# EasyEDA Pro project Cadenza-reference-ESP32-S3-game-console-original-v2-20260722.epro

# Schematic Schematic1
Board Name: Board1; Create Date: 2025-07-23; Page Name: P1; Project Name: ESP32-S3（非C3）小智AI; Schematic Name: Schematic1; Update Date: 2025-08-01; Company: 嘉立创EDA; Page Size: A4; Version: V1.0
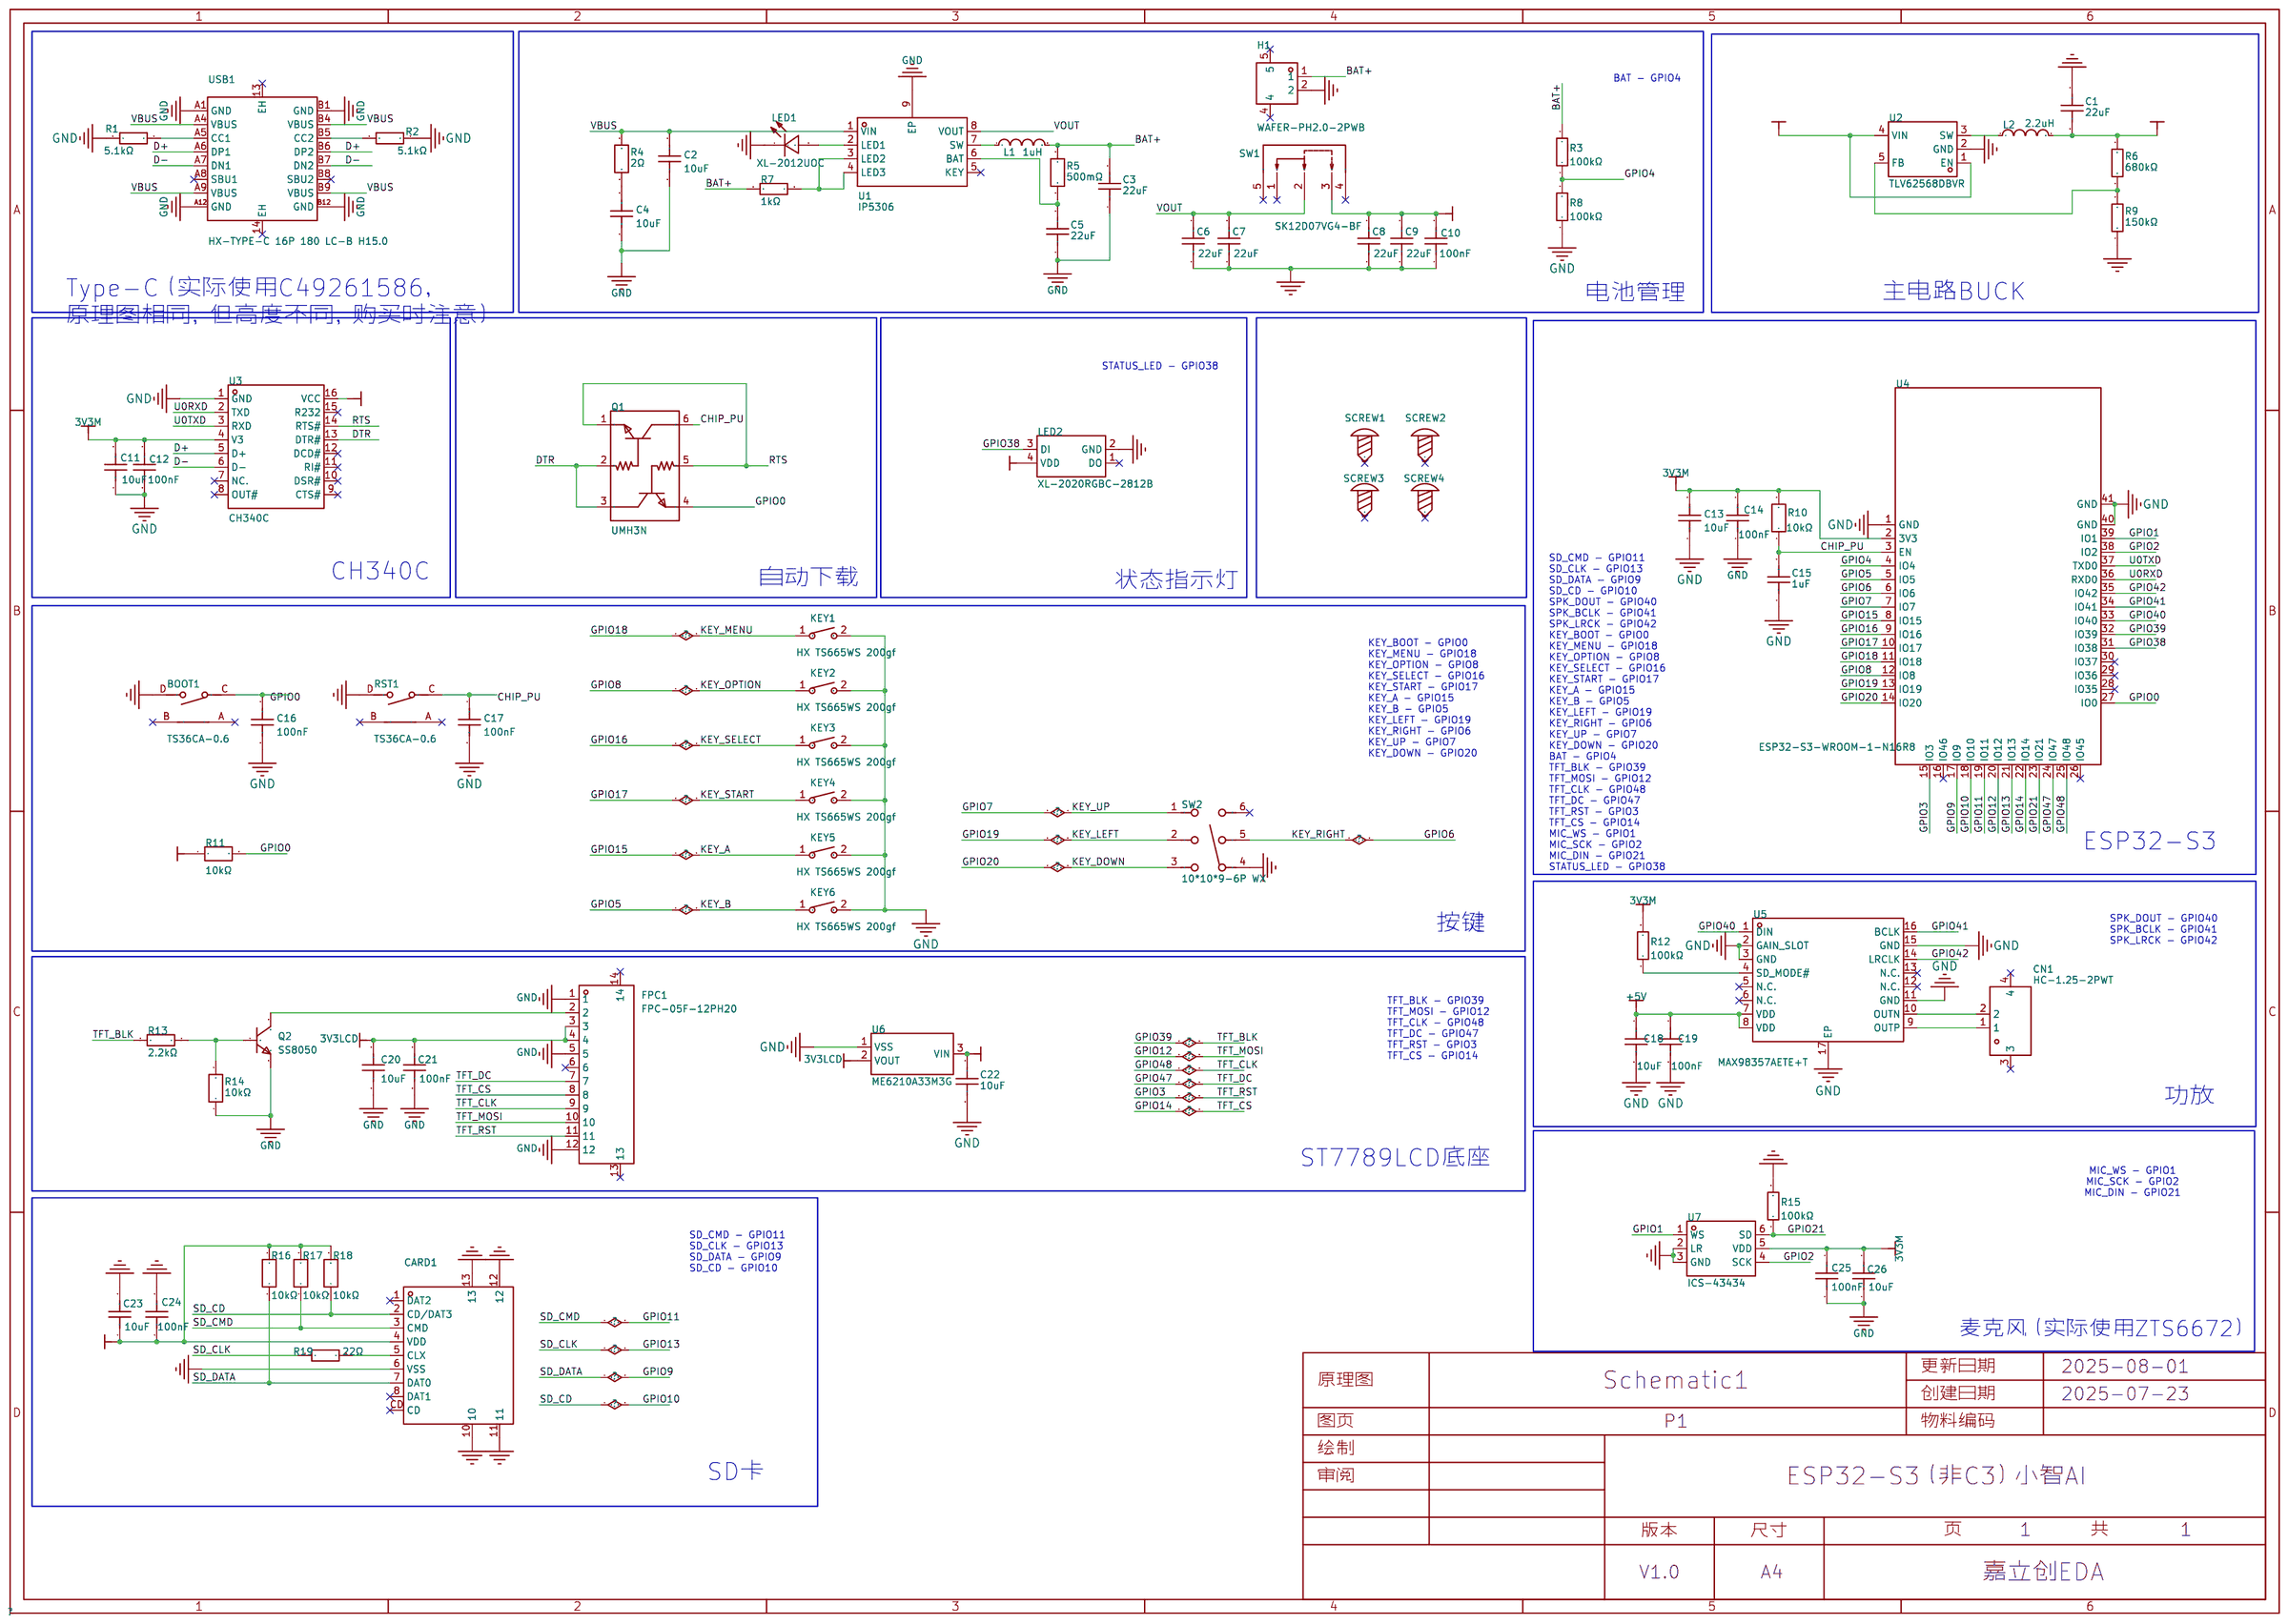
[diagram p0: schematic sheet]

## Parts
BOOT1  TS36CA-0.6  [SW-SMD_TS36CA]
C1  22uF  [C0805]
C2  10uF  [C0805]
C3  22uF  [C0805]
C4  10uF  [C0805]
C5  22uF  [C0805]
C6  22uF  [C0805]
C7  22uF  [C0805]
C8  22uF  [C0805]
C9  22uF  [C0805]
C10  100nF  [C0805]
C11  10uF  [C0805]
C12  100nF  [C0805]
C13  10uF  [C0805]
C14  100nF  [C0805]
C15  1uF  [C0805]
C16  100nF  [C0805]
C17  100nF  [C0805]
C18  10uF  [C0805]
C19  100nF  [C0805]
C20  10uF  [C0805]
C21  100nF  [C0805]
C22  10uF  [C0805]
C23  10uF  [C0805]
C24  100nF  [C0805]
C25  100nF  [C0805]
C26  10uF  [C0805]
CARD1  TF PUSH  [TF-SMD_TF-PUSH]
CN1  HC-1.25-2PWT  [CONN-SMD_2P-P1.25-HC-1.25-2PWT]
FPC1  FPC-05F-12PH20  [FPC-SMD_12P-P0.50_FPC-05F-12PH20]
H1  WAFER-PH2.0-2PWB  [CONN-SMD_2P-P2.00_XUNPU_WAFER-PH2.0-2PWB]
KEY1  HX TS665WS 200gf  [KEY-SMD_L6.0-W6.0-LS6.6]
KEY2  HX TS665WS 200gf  [KEY-SMD_L6.0-W6.0-LS6.6]
KEY3  HX TS665WS 200gf  [KEY-SMD_L6.0-W6.0-LS6.6]
KEY4  HX TS665WS 200gf  [KEY-SMD_L6.0-W6.0-LS6.6]
KEY5  HX TS665WS 200gf  [KEY-SMD_L6.0-W6.0-LS6.6]
KEY6  HX TS665WS 200gf  [KEY-SMD_L6.0-W6.0-LS6.6]
L1  1uH  [L0805]
L2  2.2uH  [IND-SMD_L3.0-W3.0_FNR30XXS]
LED1  XL-2012UOC  [LED0805-RD_ORANGE]
LED2  XL-2020RGBC-2812B  [LED-SMD_4P-L2.0-W2.0-BR-1]
Q1  UMH3N  [SC-70-6_L2.2-W1.3-P0.65-LS2.1-BR]
Q2  SS8050  [SOT-23-3_L2.9-W1.3-P1.90-LS2.4-BR]
R1  5.1kΩ  [R0805]
R2  5.1kΩ  [R0805]
R3  100kΩ  [R0805]
R4  2Ω  [R0805]
R5  500mΩ  [R0805]
R6  680kΩ  [R0805]
R7  1kΩ  [R0805]
R8  100kΩ  [R0805]
R9  150kΩ  [R0805]
R10  10kΩ  [R0805]
R11  10kΩ  [R0805]
R12  100kΩ  [R0805]
R13  2.2kΩ  [R0805]
R14  10kΩ  [R0805]
R15  100kΩ  [R0805]
R16  10kΩ  [R0805]
R17  10kΩ  [R0805]
R18  10kΩ  [R0805]
R19  22Ω  [R0805]
RST1  TS36CA-0.6  [SW-SMD_TS36CA]
SCREW1  -  [M2螺丝]
SCREW2  -  [M2螺丝]
SCREW3  -  [M2螺丝]
SCREW4  -  [M2螺丝]
SW1  SK12D07VG4-BF  [SW-TH_SK12D07VG4-BF]
SW2  10*10*9-6P WX  [SW-SMD-6P-L10.5-W10.0_C2858290]
U1  IP5306  [ESOP-8_L4.9-W3.9-P1.27-LS6.0-BL-EP]
U2  TLV62568DBVR  [SOT-23-5_L3.0-W1.7-P0.95-LS2.8-BR]
U3  CH340C  [SOP-16_L10.0-W3.9-P1.27-LS6.0-BL]
U4  ESP32-S3-WROOM-1-N16R8  [WIRELM-SMD_ESP32-S3-WROOM-1]
U5  MAX98357AETE+T  [TQFN-16_L3.0-W3.0-P0.50-BL-EP1.5]
U6  ME6210A33M3G  [SOT-23-3_L3.0-W1.7-P0.95-LS2.9-BR]
U7  ICS-43434  [MIC-SMD_6P-L3.5-W2.7-P0.90-BL]
USB1  HX-TYPE-C 16P 180 LC-B H15.0  [USB-C-TH_HX-TYPE-C-16P-180LC-BH15.0]

## Library data of the parts
BOOT1 RST1 = TS36CA-0.6: 电路结构:单刀单掷;按钮形状:矩形按钮;作用力:250gf;安装方式:卧贴;开关高度:3.5mm;触点电流:50mA;额定电压(DC):12V;绝缘电阻:100MΩ;机械寿命:3万次;; LCSC Part Name: 轻触开关 3*6*3.5侧按 直径0.6定位柱 白体黑头 250力度; Supplier Part: C2681481; Manufacturer: SHOU HAN(首韩); Supplier Footprint: SMD; JLCPCB Part Class: 扩展库; Datasheet: https://atta.szlcsc.com/upload/public/pdf/source/20210122/C2681481_EC49E45AE97AC1474E58FB36E84EF19B.pdf; Supplier: LCSC; Circuit: 单刀单掷; Actuator Style: 矩形按钮; Operating Force: 250gf; Mounting Style: 卧贴; Switch Height: 3.5mm; Contact Current: 50mA; Voltage Rating (DC): 12V; Insulation Resistance: 100MΩ; Actuator/Cap Color: 黑色; Pin Style: SMD接片; Mechanical Life: 3万次; Operating Temperature: -20℃~+70℃
C1 C3 C5-C9 = CL21A226MAQNNNE: 容值:22uF;精度:±20%;额定电压:25V;温度系数:X5R;; LCSC Part Name: 22uF ±20% 25V; Supplier Part: C45783; Manufacturer: SAMSUNG(三星); Supplier Footprint: 0805; JLCPCB Part Class: Basic Part; Datasheet: https://item.szlcsc.com/datasheet/CL21A226MAQNNNE/46786.html; Supplier: LCSC; Tolerance: ±20%; Voltage Rating: 25V; Temperature Coefficient: X5R
C2 C4 C11 C13 C18 C20 C22 C23 C26 = CGA0805X5R106K250MT: 容值:10uF;精度:±10%;额定电压:25V;温度系数:X5R;; LCSC Part Name: 10uF ±10% 25V; Supplier Part: C6119887; Manufacturer: HRE(芯声); Supplier Footprint: 0805; JLCPCB Part Class: 扩展库; Supplier: LCSC; Tolerance: ±10%; Voltage Rating: 25V; Temperature Coefficient: X5R
C10 C12 C14 C16 C17 C19 C21 C24 C25 = FCC0805B104K500DT: 容值:100nF;精度:±10%;额定电压:50V;温度系数:X7R;; LCSC Part Name: 100nF ±10% 50V; Supplier Part: C5137467; Manufacturer: FOJAN(富捷); Supplier Footprint: 0805; JLCPCB Part Class: 扩展库; Datasheet: https://atta.szlcsc.com/upload/public/pdf/source/20220818/0EB3B7FB2F5648AC16609637FBA7DABE.pdf; Supplier: LCSC; Tolerance: ±10%; Voltage Rating: 50V; Temperature Coefficient: X7R; Check: false
C15 = CGA0805X7R105K500MT: 容值:1uF;精度:±10%;额定电压:50V;温度系数:X7R;; LCSC Part Name: 1uF ±10% 50V; Supplier Part: C6119929; Manufacturer: HRE(芯声); Supplier Footprint: 0805; JLCPCB Part Class: Extended Part; Datasheet: https://item.szlcsc.com/datasheet/CGA0805X7R105K500MT/7062635.html; Supplier: LCSC; Tolerance: ±10%; Voltage Rating: 50V; Temperature Coefficient: X7R
CARD1 = TF PUSH: 卡连接方式:自弹式;卡类型:MicroSD卡(TF卡);连接器类型:卡座;本体最大高度:2mm;工作温度:-25℃~+90℃;; LCSC Part Name: 自弹式 MicroSD卡(TF卡) 卡座; Supplier Part: C393941; Manufacturer: SHOU HAN(首韩); Supplier Footprint: SMD; JLCPCB Part Class: Extended Part; Datasheet: https://item.szlcsc.com/datasheet/TF%2520PUSH/372553.html; Supplier: LCSC; Card Connection Mode: 自弹式; Card Type: MicroSD卡(TF卡); Connector Type: 卡座; Additional Card Detection Pins: 无; Height Above Board: 2mm; Operating Temperature: -25℃~+90℃
CN1 = HC-1.25-2PWT: 插针结构:1x2P;间距:1.25mm;安装方式:卧贴;参考系列:PicoBlade(MX 1.25);总PIN数:2P;排数:1;每排PIN数:2;行距:-;额定电流:1A;触头材质:黄铜;触头镀层:锡;工作温度范围:-40℃~+105℃;; LCSC Part Name: 1x2P 间距:1.25mm 卧贴 系列:PicoBlade(MX 1.25); Supplier Part: C2845379; Manufacturer: HCTL(华灿天禄); Supplier Footprint: SMD,P=1.25mm,卧贴; JLCPCB Part Class: 扩展库; Datasheet: https://atta.szlcsc.com/upload/public/pdf/source/20240930/9508A8292CCC87B0C29E3A028D56E30A.pdf; Supplier: LCSC; Pins Structure: 1x2P; Pitch: 1.25mm; Mounting Style: 卧贴; Reference Series: PicoBlade(MX 1.25); Number of Pins: 2P; Number of Rows: 1; Number of PINs Per Row: 2; Current Rating (Max): 1A; Contact Material: 黄铜; Contact Plating: 锡; Operating Temperature Range: -40℃~+105℃; Rated Voltage (Max): 125V; Plastic Material: LCP; Flame Retardant Rating: UL94V-0; Supplementary Features: 辅助焊脚; Z-Height of the Board: 3.57mm; X-Length of Bottom Edge on Board (Spacing Line): 7.55mm; Y-Width of Bottom Edge on Board: 5.25mm
FPC1 = FPC-05F-12PH20: 锁定特性:翻盖式;触点类型:卧贴;触点数量:12P;间距:0.5mm;安装方式:下接;工作温度:-25℃~+85℃;; LCSC Part Name: 翻盖式 卧贴 P数:12P 间距:0.5mm; Supplier Part: C2856799; Manufacturer: XUNPU(讯普); Supplier Footprint: SMD,P=0.5mm,卧贴; JLCPCB Part Class: Extended Part; Datasheet: https://item.szlcsc.com/datasheet/FPC-05F-12PH20/3056897.html; Supplier: LCSC; Locking Feature: 翻盖式; Contact Type: 卧贴; Number of Contacts: 12P; Pitch: 0.5mm; Mounting Type: 下接; FFC, FCB Thickness: 0.3mm; Height Above Board: 2mm; Contact Material: 磷青铜; Contact Plating: 锡; Operating Temperature: -25℃~+85℃; Rated Voltage (Max): 50V; Current Rating (Max): 500mA
H1 = WAFER-PH2.0-2PWB: 插针结构:1x2P;间距:2mm;安装方式:卧贴;总PIN数:2P;排数:1;每排PIN数:2;额定电流:2A;工作温度范围:-25℃~+85℃;; LCSC Part Name: 1x2P 间距:2mm 卧贴; Supplier Part: C3029440; Manufacturer: XUNPU(讯普); Supplier Footprint: SMD,P=2mm,卧贴; JLCPCB Part Class: 扩展库; Datasheet: https://atta.szlcsc.com/upload/public/pdf/source/20220527/83903C18429EFE4C9EEE8C529A248431.pdf; Supplier: LCSC; Pins Structure: 1x2P; Pitch: 2mm; Mounting Type: 卧贴; Reference Series: PH; Number of Pins: 2P; Number of Rows: 1; Number of PINs Per Row: 2; Current Rating: 2A; Contact Material: 黄铜; Contact Plating: 锡; Operating Temperature: -25℃~+85℃; Voltage Rating: 250V; Plastic Material: LCP; Supplementary Features: 辅助焊脚; Color: 米色; Z-Height of the Board: 5.6mm; X-Length of Bottom Edge on Board (Spacing Line): 8mm; Y-Width of Bottom Edge on Board: 7.59mm; Mounting Style: 卧贴; Current Rating (Max): 2A; Operating Temperature Range: -25℃~+85℃
KEY1-KEY6 = HX TS665WS 200gf: 开关长度:6mm;开关宽度:6mm;开关高度:5mm;机械寿命:-;; LCSC Part Name: 6*6*5mm 贴片 轻触开关; Supplier Part: C5143657; Manufacturer: hanxia(韩下); Supplier Footprint: SMD; JLCPCB Part Class: Extended Part; Datasheet: https://atta.szlcsc.com/upload/public/pdf/source/20220824/E3A0D3616D5973F89F10D1A814F7F507.pdf; Supplier: LCSC; Circuit: 单刀单掷; Actuator Style: 圆形按钮; Operating Force: 2N; Mounting Type: 立贴; Length: 6mm; Width: 6mm; Switch Height: 5mm; with Bracket: 不带支架; Contact Current: 50mA; Voltage Rating: 12V; Actuator/Cap Color: 灰色; With Lamp: 无; Termination Style: SMD接片; Life: 10万次; Operating Temperature: -40℃~+85℃; Switch Length: 6mm; Switch Width: 6mm
L1 = MLP2012S1R0MT0S1: 电感值:1uH;精度:±20%;额定电流:1A;饱和电流(Isat):-;直流电阻(DCR):160mΩ;; LCSC Part Name: 1uH ±20%; Supplier Part: C383371; Manufacturer: TDK; Supplier Footprint: 0805; JLCPCB Part Class: Extended Part; Datasheet: https://atta.szlcsc.com/upload/public/pdf/source/20190403/C383376_2CC82C33953452D360DB6C4C6709FA52.pdf; Supplier: LCSC; Tolerance: ±20%; Rated Current: 1A; DC Resistance (DCR): 160mΩ
L2 = FNR3015S2R2MT: 电感值:2.2uH;精度:±20%;额定电流:2A;饱和电流(Isat):2A;类型:磁胶屏蔽电感;; LCSC Part Name: 2.2uH ±20% 2A; Supplier Part: C167747; Manufacturer: cjiang(长江微电); Supplier Footprint: SMD,3x3mm; JLCPCB Part Class: Extended Part; Datasheet: https://item.szlcsc.com/datasheet/FNR3015S2R2MT/179130.html; Supplier: LCSC; Tolerance: ±20%; Current Rating: 2A; Current - Saturation(Isat): 2A; DC Resistance(DCR): 78mΩ; Type: 磁胶屏蔽电感
LED1 = XL-2012UOC: 灯头类型:-;发光颜色:橙色;正向压降(Vf):2.3V;功率:50mW;正向电流:20mA;波长:600nm~610nm;二极管配置:独立二极管;透镜颜色:无色透明透镜;色温:-;发光强度:330mcd;发光角度:120°;载带方式:正贴;工作温度:-40℃~+85℃;; LCSC Part Name: 0805橙贴片式发光二极管; Supplier Part: C965813; Manufacturer: XINGLIGHT(成兴光); Supplier Footprint: 0805; JLCPCB Part Class: Extended Part; Datasheet: https://item.szlcsc.com/datasheet/XL-2012UOC/1051422.html; Supplier: LCSC; Illumination Color: 橙色; Voltage - Forward(Vf): 2.3V; Power(Watts): 50mW; Forward Current: 20mA; Wavelength - Dominant: 600nm~610nm; Peak Wavelength: 605nm; Diode Configuration: 独立二极管; Lens Color: 无色透明透镜; Luminous Intensity: 330mcd; Viewing Angle: 120°; Mounting Style: 正贴; Operating Temperature: -40℃~+85℃
LED2 = XL-2020RGBC-2812B: 2020幻彩透明   内置驱动 IC   WS2812B; LCSC Part Name: 幻彩透明 XL-2020RGBC-WS2812B; Supplier Part: C5349955; Manufacturer: XINGLIGHT(成兴光); Supplier Footprint: 2020; JLCPCB Part Class: Extended Part; Datasheet: https://item.szlcsc.com/datasheet/XL-2020RGBC-2812B/6136404.html; Supplier: LCSC; Wavelength: R:620nm~625nm；B:470nm~475nm；G:525nm~530nm; Luminous Intensity: 150mcd；150mcd；400mcd; Fixed-Frequency Pwm Mode: 1.5kHz; Data Transmission Rate: 800Kbit/s; Voltage - Supply: 3.5V~5.5V; Quiescent Current: 0.5mA; Lens Color: 半透明雾状透镜; ESD Withstand Voltage: 2000V; Installation method: 正贴; Operating Temperature: -40℃~+85℃; Peak Wavelength: R:625nm；B:470nm；G:525nm; Viewing Angle: 120°; Length: 2mm; Width: 0.65mm; Height: 2mm
Q1 = UMH3N: 晶体管类型:2个NPN-预偏置;功率(Pd):150mW;集电极电流(Ic):100mA;集射极击穿电压(Vceo):50V;; LCSC Part Name: 2个NPN-预偏置 100mA 50V; Supplier Part: C62892; Manufacturer: CJ(江苏长电/长晶); Supplier Footprint: SC-70-6(SOT-363); JLCPCB Part Class: Extended Part; Datasheet: https://atta.szlcsc.com/upload/public/pdf/source/20151109/1457707575095.pdf; Supplier: LCSC; Collector - Emitter Voltage VCEO: 50V; Current - Collector(Ic): 100mA; Pd - Power Dissipation: 150mW; DC Current Gain: 100@1mA,5V; Emitter-Base Voltage VEBO: 5V; Input Resistor: 6.11kΩ; Operating Temperature: -55℃~+150℃; Transistor Type: 2个NPN-预偏置; Power Dissipation (Pd): 150mW; Collector Current (Ic): 100mA; Collector-Emitter Breakdown Voltage (Vceo): 50V
Q2 = SS8050_C7420370: 晶体管类型:NPN;集电极电流(Ic):1.5A;集射极击穿电压(Vceo):25V;耗散功率(Pd):300mW;直流电流增益(hFE):120@100mA,1.0V;; LCSC Part Name: H档 200-350 NPN 电流:1.5A 电压:25V; Supplier Part: C7420370; Manufacturer: R+O(宏嘉诚); Supplier Footprint: SOT-23; JLCPCB Part Class: Extended Part; Datasheet: https://item.szlcsc.com/datasheet/SS8050/8397192.html; Supplier: LCSC; type: NPN; Current - Collector(Ic): 1.5A; Collector - Emitter Voltage VCEO: 25V; Pd - Power Dissipation: 300mW; DC Current Gain: 120@100mA,1.0V; Transition frequency(fT): 100MHz; Current - Collector Cutoff: 100nA; Vce Saturation(VCE(sat)): 500mV; Operating Temperature: -55℃~+150℃; Emitter-Base Voltage(Vebo): 5V
R1 R2 = 0805W8F5101T5E: 电阻类型:厚膜电阻;阻值:5.1kΩ;精度:±1%;功率:125mW;最大工作电压:150V;温度系数:±100ppm/℃;; LCSC Part Name: 5.1kΩ ±1% 125mW 厚膜电阻; Supplier Part: C27834; Manufacturer: UNI-ROYAL(厚声); Supplier Footprint: 0805; JLCPCB Part Class: 基础库; Datasheet: https://atta.szlcsc.com/upload/public/pdf/source/20200306/C422600_1E6D84923E4A46A82E41ADD87F860B5C.pdf; Supplier: LCSC; Type: 厚膜电阻; Tolerance: ±1%; Power(Watts): 125mW; Overload Voltage (Max): 150V; Temperature Coefficient: ±100ppm/℃; Operating Temperature Range: -55℃~+155℃
R3 R8 R12 R15 = 0805W8F1003T5E: 电阻类型:厚膜电阻;阻值:100kΩ;精度:±1%;功率:125mW;最大工作电压:150V;温度系数:±100ppm/℃;; LCSC Part Name: 100kΩ ±1% 125mW 厚膜电阻; Supplier Part: C149504; Manufacturer: UNI-ROYAL(厚声); Supplier Footprint: 0805; JLCPCB Part Class: 基础库; Datasheet: https://atta.szlcsc.com/upload/public/pdf/source/20200306/C422600_1E6D84923E4A46A82E41ADD87F860B5C.pdf; Supplier: LCSC; Type: 厚膜电阻; Tolerance: ±1%; Power(Watts): 125mW; Overload Voltage (Max): 150V; Temperature Coefficient: ±100ppm/℃; Operating Temperature Range: -55℃~+155℃
R4 = FRC0805J2R0TS: 电阻类型:厚膜电阻;阻值:2Ω;精度:±5%;功率:125mW;工作电压:150V;温度系数:±200ppm/℃;; LCSC Part Name: 2Ω ±5% 125mW 厚膜电阻; Supplier Part: C2930265; Manufacturer: FOJAN(富捷); Supplier Footprint: 0805; JLCPCB Part Class: Extended Part; Supplier: LCSC; Type: 厚膜电阻; Tolerance: ±5%; Power(Watts): 125mW; Voltage-Supply(Max): 150V; Temperature Coefficient: ±200ppm/℃; Operating Temperature: -55℃~+155℃
R5 = FRL0805JR500TS: 电阻类型:厚膜电阻;阻值:500mΩ;精度:±5%;功率:125mW;工作电压:300V;温度系数:±300ppm/℃;; LCSC Part Name: 500mΩ ±5% 125mW 厚膜电阻; Supplier Part: C2934281; Manufacturer: FOJAN(富捷); Supplier Footprint: 0805; JLCPCB Part Class: Extended Part; Supplier: LCSC; Type: 厚膜电阻; Tolerance: ±5%; Power(Watts): 125mW; Voltage-Supply(Max): 300V; Temperature Coefficient: ±300ppm/℃; Operating Temperature: -55℃~+155℃
R6 = 0805W8F6803T5E: 电阻类型:厚膜电阻;阻值:680kΩ;精度:±1%;功率:125mW;工作电压:150V;温度系数:±100ppm/℃;; LCSC Part Name: 680kΩ ±1% 125mW 厚膜电阻; Supplier Part: C17797; Manufacturer: UNI-ROYAL(厚声); Supplier Footprint: 0805; JLCPCB Part Class: Extended Part; Datasheet: https://item.szlcsc.com/datasheet/0805W8F6803T5E/18485.html; Supplier: LCSC; Type: 厚膜电阻; Tolerance: ±1%; Power(Watts): 125mW; Voltage-Supply(Max): 150V; Temperature Coefficient: ±100ppm/℃; Operating Temperature: -55℃~+155℃
R7 = 0805W8F1001T5E: 电阻类型:厚膜电阻;阻值:1kΩ;精度:±1%;功率:125mW;最大工作电压:150V;温度系数:±100ppm/℃;; LCSC Part Name: 1kΩ ±1% 125mW 厚膜电阻; Supplier Part: C17513; Manufacturer: UNI-ROYAL(厚声); Supplier Footprint: 0805; JLCPCB Part Class: 基础库; Datasheet: https://atta.szlcsc.com/upload/public/pdf/source/20200306/C422600_1E6D84923E4A46A82E41ADD87F860B5C.pdf; Supplier: LCSC; Type: 厚膜电阻; Tolerance: ±1%; Power(Watts): 125mW; Overload Voltage (Max): 150V; Temperature Coefficient: ±100ppm/℃; Operating Temperature Range: -55℃~+155℃
R9 = 0805W8F1503T5E: 电阻类型:厚膜电阻;阻值:150kΩ;精度:±1%;功率:125mW;最大工作电压:150V;温度系数:±100ppm/℃;; LCSC Part Name: 150kΩ ±1% 125mW 厚膜电阻; Supplier Part: C17470; Manufacturer: UNI-ROYAL(厚声); Supplier Footprint: 0805; JLCPCB Part Class: Basic Part; Datasheet: https://atta.szlcsc.com/upload/public/pdf/source/20200306/C422600_1E6D84923E4A46A82E41ADD87F860B5C.pdf; Supplier: LCSC; Type: 厚膜电阻; Tolerance: ±1%; Power(Watts): 125mW; Overload Voltage (Max): 150V; Temperature Coefficient: ±100ppm/℃; Operating Temperature Range: -55℃~+155℃
R10 R11 R14 R16-R18 = FRC0805J103TS: 电阻类型:厚膜电阻;阻值:10kΩ;精度:±5%;功率:125mW;最大工作电压:150V;温度系数:±100ppm/℃;; LCSC Part Name: 10kΩ ±5% 125mW 厚膜电阻; Supplier Part: C2930231; Manufacturer: FOJAN(富捷); Supplier Footprint: 0805; JLCPCB Part Class: 扩展库; Datasheet: https://atta.szlcsc.com/upload/public/pdf/source/20211221/925EC7D7225764EE0046F22065062C87.pdf; Supplier: LCSC; Type: 厚膜电阻; Tolerance: ±5%; Power(Watts): 125mW; Overload Voltage (Max): 150V; Temperature Coefficient: ±100ppm/℃; Operating Temperature Range: -55℃~+155℃
R13 = 0805W8F2201T5E: 电阻类型:厚膜电阻;阻值:2.2kΩ;精度:±1%;功率:125mW;工作电压:150V;温度系数:±100ppm/℃;; LCSC Part Name: 2.2kΩ ±1% 125mW 厚膜电阻; Supplier Part: C17520; Manufacturer: UNI-ROYAL(厚声); Supplier Footprint: 0805; JLCPCB Part Class: Basic Part; Datasheet: https://item.szlcsc.com/datasheet/0805W8F2201T5E/18208.html; Supplier: LCSC; Type: 厚膜电阻; Tolerance: ±1%; Power(Watts): 125mW; Voltage-Supply(Max): 150V; Temperature Coefficient: ±100ppm/℃; Operating Temperature: -55℃~+155℃
R19 = 0805W8F220JT5E: 电阻类型:厚膜电阻;阻值:22Ω;精度:±1%;功率:125mW;工作电压:150V;温度系数:±100ppm/℃;; LCSC Part Name: 22Ω ±1% 125mW 厚膜电阻; Supplier Part: C17561; Manufacturer: UNI-ROYAL(厚声); Supplier Footprint: 0805; JLCPCB Part Class: Basic Part; Datasheet: https://item.szlcsc.com/datasheet/0805W8F220JT5E/18249.html; Supplier: LCSC; Type: 厚膜电阻; Tolerance: ±1%; Power(Watts): 125mW; Voltage-Supply(Max): 150V; Temperature Coefficient: ±100ppm/℃; Operating Temperature: -55℃~+155℃
SCREW1-SCREW4 = M2螺丝: Supplier Footprint: 插件
SW1 = SK12D07VG4-BF: 电路结构:单刀双掷;安装方式:弯插;额定电流:300mA;额定电压:50V;工作寿命:8千次;; LCSC Part Name: SK12D07VG4耐温过波峰焊; Supplier Part: C49451756; Manufacturer: SHOU HAN(首韩); Supplier Footprint: 插件; JLCPCB Part Class: Extended Part; Datasheet: https://item.szlcsc.com/datasheet/SK12D07VG4-BF/51997278.html; Supplier: LCSC; Circuit: 单刀双掷; Actuator Style: 矩形柱状; Length: 8.7mm; Width: 4.7mm; Mounting Type: 弯插; Current Rating: 300mA; Voltage Rating: 50V; Life: 8千次; Operating Temperature: -25℃~+70℃
SW2 = 10*10*9-6P WX: 10x10x9mm,6脚立贴; LCSC Part Name: 10*10*9-6P贴片五向开关编带; Supplier Part: C2858290; Manufacturer: SHOU HAN(首韩); Supplier Footprint: SMD-6P,10x10mm; JLCPCB Part Class: Extended Part; Datasheet: https://item.szlcsc.com/datasheet/10*10*9-6P%2520WX/3059440.html; Supplier: LCSC; Mounting Type: 立贴; Voltage Rating: 12V; Current Rating: 50mA; Mechanical Life: 5万次; Operating Temperature: -20℃~+70℃
U1 = IP5306: 工作电压:4.65V~5.5V;最大充电电流:2.1A;电池类型:锂电池;电池节数:1;; LCSC Part Name: 集成2.1A充电器和2.1A放电器的全集成移动电源系统级芯片; Supplier Part: C181692; Manufacturer: INJOINIC(英集芯); Supplier Footprint: ESOP-8; JLCPCB Part Class: Extended Part; Datasheet: https://item.szlcsc.com/datasheet/IP5306/193089.html; Supplier: LCSC; The Chip Type: 充电芯片；保护芯片; Voltage - Supply: 4.65V~5.5V; Charge Current - Max: 2.1A; Charging Saturation Voltage: 4.2V; End-Off Voltage: 3V; Type of Battery: 锂电池; Number of Cells: 1; Operating Temperature: 0℃~+70℃; Battery Temperature Detection: 不支持; 0V Battery Charge: 不支持; Supply Current (Iq): 100uA; Interface: I2C; Features: 过流保护；恒流充电；自动再充电；充电终止；过压保护；欠压锁定；过放保护；涓流充电；短路保护
U2 = TLV62568DBVR: 功能类型:降压型;工作电压:2.5V~5.5V;输出电压:600mV~5.5V;输出电流:1A;输出类型:可调;; LCSC Part Name: 1A高效同步降压转换器; Supplier Part: C163219; Manufacturer: TI(德州仪器); Supplier Footprint: SOT-23-5; JLCPCB Part Class: Extended Part; Datasheet: https://www.ti.com/cn/lit/gpn/tlv62568; Supplier: LCSC; Function: 降压型; Voltage - Supply: 2.5V~5.5V; Output Voltage: 600mV~5.5V; Output Current: 1A; Frequency - Switching: 1.5MHz; Operating Temperature: -40℃~+125℃@(TJ); Synchronous Rectifier: 是; Number of Outputs: 1; Topology: 降压式; Quiescent Current: 35uA; Switch tube (built-in/external): 内置; Output Type: 可调
U3 = CH340C: 应用功能:收发器;接口协议:USB 2.0;数据速率:2Mbps;; Supplier Part: C84681; Manufacturer: WCH(南京沁恒); Supplier Footprint: SOP-16; JLCPCB Part Class: 扩展库; Datasheet: https://atta.szlcsc.com/upload/public/pdf/source/20240619/63986D8440D4E5267A77ACD891CC4DE3.pdf; Supplier: LCSC; Applications Function: 收发器; Protocol: USB 2.0; Voltage - Supply: 3.3V；5V; Data Rate: 2Mbps
U4 = ESP32-S3-WROOM-1-N16R8: LCSC Part Name: 通用型Wi-Fi+低功耗蓝牙MCU模组; Supplier Part: C2913202; Manufacturer: ESPRESSIF(乐鑫); Supplier Footprint: SMD,18x25.5mm; JLCPCB Part Class: 扩展库; Datasheet: https://atta.szlcsc.com/upload/public/pdf/source/20241030/6A412B13087E1327DF6279F5735253CA.pdf; Supplier: LCSC
U5 = MAX98357AETE+T: 功放类型:-;扬声器通道数:-;输出功率:-;静态电流(Iq):-;; LCSC Part Name: 微型、低成本、PCM 类 D 级放大器具有 AB 级性能; Supplier Part: C910544; Manufacturer: ADI(亚德诺)/MAXIM(美信); Supplier Footprint: TQFN-16-EP(3x3); JLCPCB Part Class: 扩展库; Datasheet: https://atta.szlcsc.com/upload/public/pdf/source/20210106/C910544_CB6DE4B2CEE254A72E6BDB40E718D281.pdf; Supplier: LCSC; Voltage - Supply: 2.5V~5.5V; Operating Temperature: -40℃~+85℃
U6 = ME6210A33M3G: 输出类型:固定;工作电压:18V;输出电压:3.3V;输出电流:500mA;电源纹波抑制比(PSRR):-;输出极性:正极;; LCSC Part Name: 输入18V 输出3.3V 500mA; Supplier Part: C236680; Manufacturer: MICRONE(南京微盟); Supplier Footprint: SOT23-3; JLCPCB Part Class: Extended Part; Datasheet: https://atta.szlcsc.com/upload/public/pdf/source/20190709/C403652_164B03470289BC6E2EF0FCF22B47472A.pdf; Supplier: LCSC; Output Type: 固定; Voltage - Supply: 18V; Output Voltage: 3.3V; Output Current: 500mA; Voltage Dropout: 10mV@(10mA); standby current: 1.6uA; Features: 短路保护; Operating Temperature: -25℃~+85℃; Output Configuration: 正极; Number of Outputs: 1
U7 = ICS-43434_C5656610: 指向性:全指向;信噪比:64dB;灵敏度:-;; Supplier Part: C5656610; Manufacturer: TDK InvenSense(应美盛); JLCPCB Part Class: 扩展库; Datasheet: https://atta.szlcsc.com/upload/public/pdf/source/231023/DS-000069-ICS-43434-v1.2-8194c7772d771e21a553109502704f97.pdf; Supplier: LCSC; Direction: 全指向; Voltage - Supply: 1.65V~3.63V; Current Consumption: 550uA; S/N Ratio: 64dB
USB1 = HX-TYPE-C 16P 180 LC-B H15.0: 连接器类型:Type-C;协议标准:USB 3.1;公母:母;安装方式:直插;触点数量:16P;端口数量:1;额定电流 - 电源:3A;工作温度:-30℃~+80℃;; LCSC Part Name: Type-C 母 直插; Supplier Part: C49261588; Manufacturer: hanxia(韩下); Supplier Footprint: 插件; JLCPCB Part Class: Extended Part; Datasheet: https://item.szlcsc.com/datasheet/HX-TYPE-C%252016P%2520180%2520LC-B%2520H15.0/51704542.html; Supplier: LCSC; Connector Type: Type-C; Protocol Standard: USB 3.1; Gender: 母; Mounting Type: 直插; Number of Contacts: 16P; Number of Ports: 1; Current Rating-Power: 3A; Voltage Rating: 20V; Connect-Disconnect Life: 1万次; Length: 15mm; Detection color: 黑色; Operating Temperature: -30℃~+80℃

## Nets
3V3LCD: C20.2 C21.1 FPC1.3 FPC1.4 U6.2(VOUT)
3V3M: C1.2 C11.2 C12.2 C13.2 C14.2 C22.1 C23.1 C24.1 C25.1 C26.2 CARD1.4(VDD) L2.2 LED2.4(VDD) R6.2 R10.2 R11.1 R12.2 R16.2 R17.2 R18.2 U3.4(V3) U3.16(VCC) U4.2(3V3) U6.3(VIN) U7.5(VDD)
+5V: C8.2 C9.2 C10.2 C18.1 C19.1 SW1.3 U2.1(EN) U2.4(VIN) U5.7(VDD) U5.8(VDD)
GND: BOOT1.D C1.1 C2.1 C3.1 C4.1 C5.1 C6.1 C7.1 C8.1 C9.1 C10.1 C11.1 C12.1 C13.1 C14.1 C15.1 C16.2 C17.2 C18.2 C19.2 C20.1 C21.2 C22.2 C23.2 C24.2 C25.2 C26.1 CARD1.6(VSS) CARD1.10 CARD1.11 CARD1.12 CARD1.13 FPC1.1 FPC1.5 FPC1.12 H1.2 KEY1.2 KEY2.2 KEY3.2 KEY4.2 KEY5.2 KEY6.2 LED1.1(-) LED2.2(GND) Q2.2(E) R1.2 R2.1 R8.1 R9.1 R14.1 R15.2 RST1.D SW2.4 U1.9(EP) U2.2(GND) U3.1(GND) U4.1(GND) U4.40(GND) U4.41(GND) U5.2(GAIN_SLOT) U5.3(GND) U5.11(GND) U5.15(GND) U5.17(EP) U6.1(VSS) U7.2(LR) U7.3(GND) USB1.A1(GND) USB1.A12(GND) USB1.B1(GND) USB1.B12(GND)
VBUS: C2.2 R4.2 U1.1(VIN) USB1.A4(VBUS) USB1.A9(VBUS) USB1.B4(VBUS) USB1.B9(VBUS)
BAT+: C3.2 H1.1 L1.2 R3.2 R5.2 R7.2
CHIP_PU: C15.2 C17.1 Q1.6(C) R10.1 RST1.C U4.3(EN)
D+: U3.5(D+) USB1.A6(DP1) USB1.B6(DP2)
D-: U3.6(D-) USB1.A7(DN1) USB1.B7(DN2)
DTR: Q1.2(B) Q1.3(C) U3.13(DTR#)
GPIO0: BOOT1.C C16.1 Q1.4(E) R11.2 U4.27(IO0)
GPIO1: U4.39(IO1) U7.1(WS)
GPIO2: U4.38(IO2) U7.4(SCK)
GPIO3: FPC1.11 U4.15(IO3)
GPIO4: R3.1 R8.2 U4.4(IO4)
GPIO5: KEY6.1 U4.5(IO5)
GPIO6: SW2.5 U4.6(IO6)
GPIO7: SW2.1 U4.7(IO7)
GPIO8: KEY2.1 U4.12(IO8)
GPIO9: CARD1.7(DAT0) R16.1 U4.17(IO9)
GPIO10: CARD1.2(CD/DAT3) R18.1 U4.18(IO10)
GPIO11: CARD1.3(CMD) R17.1 U4.19(IO11)
GPIO12: FPC1.10 U4.20(IO12)
GPIO13: R19.1 U4.21(IO13)
GPIO14: FPC1.8 U4.22(IO14)
GPIO15: KEY5.1 U4.8(IO15)
GPIO16: KEY3.1 U4.9(IO16)
GPIO17: KEY4.1 U4.10(IO17)
GPIO18: KEY1.1 U4.11(IO18)
GPIO19: SW2.2 U4.13(IO19)
GPIO20: SW2.3 U4.14(IO20)
GPIO21: R15.1 U4.23(IO21) U7.6(SD)
GPIO38: LED2.3(DI) U4.31(IO38)
GPIO39: R13.1 U4.32(IO39)
GPIO40: U4.33(IO40) U5.1(DIN)
GPIO41: U4.34(IO41) U5.16(BCLK)
GPIO42: U4.35(IO42) U5.14(LRCLK)
GPIO47: FPC1.7 U4.24(IO47)
GPIO48: FPC1.9 U4.25(IO48)
RTS: Q1.1(E) Q1.5(B) U3.14(RTS#)
U0RXD: U3.2(TXD) U4.36(RXD0)
U0TXD: U3.3(RXD) U4.37(TXD0)
VOUT: C6.2 C7.2 SW1.2 U1.8(VOUT)
$1N34531: Q2.1(B) R13.2 R14.2
$1N34538: FPC1.2 Q2.3(C)
$1N34554: R1.1 USB1.A5(CC1)
$1N34556: R2.2 USB1.B5(CC2)
$1N34586: C5.2 R5.1 U1.6(BAT)
$1N34588: L1.1 U1.7(SW)
$1N34595: LED1.2(+) U1.2(LED1)
$1N34601: R7.1 U1.3(LED2) U1.4(LED3)
$1N34619: C4.2 R4.1
$1N34652: L2.1 U2.3(SW)
$1N34657: R6.1 R9.2 U2.5(FB)
$1N34720: CN1.1 U5.9(OUTP)
$1N34722: CN1.2 U5.10(OUTN)
$1N34731: R12.1 U5.4(SD_MODE#)
$1N34770: CARD1.5(CLX) R19.2

Not connected (* = marked no-connect by the designer): BOOT1 A* B*; CARD1 1(DAT2)* 8(DAT1)* CD*; CN1 3* 4*; FPC1 6* 13* 14*; H1 4* 5*; LED2 1(DO)*; RST1 A* B*; SCREW1 1*; SCREW2 1*; SCREW3 1*; SCREW4 1*; SW1 1* 4* 5*; SW2 6*; U1 5(KEY)*; U3 7(NC.)* 8(OUT#)* 9(CTS#)* 10(DSR#)* 11(RI#)* 12(DCD#)* 15(R232)*; U4 16(IO46)* 26(IO45)* 28(IO35)* 29(IO36)* 30(IO37)*; U5 5(N.C.)* 6(N.C.)* 12(N.C.)* 13(N.C.)*; USB1 13(EH)* 14(EH)* A8(SBU1)* B8(SBU2)*

## Notes on the sheet
- BAT - GPIO4
- Type-C（实际使用C49261586，
  原理图相同，但高度不同，购买时注意）
- 电池管理
- 主电路BUCK
- STATUS_LED - GPIO38
- SD_CMD - GPIO11
  SD_CLK - GPIO13
  SD_DATA - GPIO9
  SD_CD - GPIO10
  SPK_DOUT - GPIO40
  SPK_BCLK - GPIO41
  SPK_LRCK - GPIO42
  KEY_BOOT - GPIO0
  KEY_MENU - GPIO18
  KEY_OPTION - GPIO8
  KEY_SELECT - GPIO16
  KEY_START - GPIO17
  KEY_A - GPIO15
  KEY_B - GPIO5
  KEY_LEFT - GPIO19
  KEY_RIGHT - GPIO6
  KEY_UP - GPIO7
  KEY_DOWN - GPIO20
  BAT - GPIO4
  TFT_BLK - GPIO39
  TFT_MOSI - GPIO12
  TFT_CLK - GPIO48
  TFT_DC - GPIO47
  TFT_RST - GPIO3
  TFT_CS - GPIO14
  MIC_WS - GPIO1
  MIC_SCK - GPIO2
  MIC_DIN - GPIO21
  STATUS_LED - GPIO38
- CH340C
- 自动下载
- 状态指示灯
- KEY_BOOT - GPIO0
  KEY_MENU - GPIO18
  KEY_OPTION - GPIO8
  KEY_SELECT - GPIO16
  KEY_START - GPIO17
  KEY_A - GPIO15
  KEY_B - GPIO5
  KEY_LEFT - GPIO19
  KEY_RIGHT - GPIO6
  KEY_UP - GPIO7
  KEY_DOWN - GPIO20
- ESP32-S3
- SPK_DOUT - GPIO40
  SPK_BCLK - GPIO41
  SPK_LRCK - GPIO42
- 按键
- TFT_BLK - GPIO39
  TFT_MOSI - GPIO12
  TFT_CLK - GPIO48
  TFT_DC - GPIO47
  TFT_RST - GPIO3
  TFT_CS - GPIO14
- 功放
- ST7789LCD底座
- MIC_WS - GPIO1
  MIC_SCK - GPIO2
  MIC_DIN - GPIO21
- SD_CMD - GPIO11
  SD_CLK - GPIO13
  SD_DATA - GPIO9
  SD_CD - GPIO10
- 麦克风（实际使用ZTS6672）
- SD卡

# Board PCB1_1
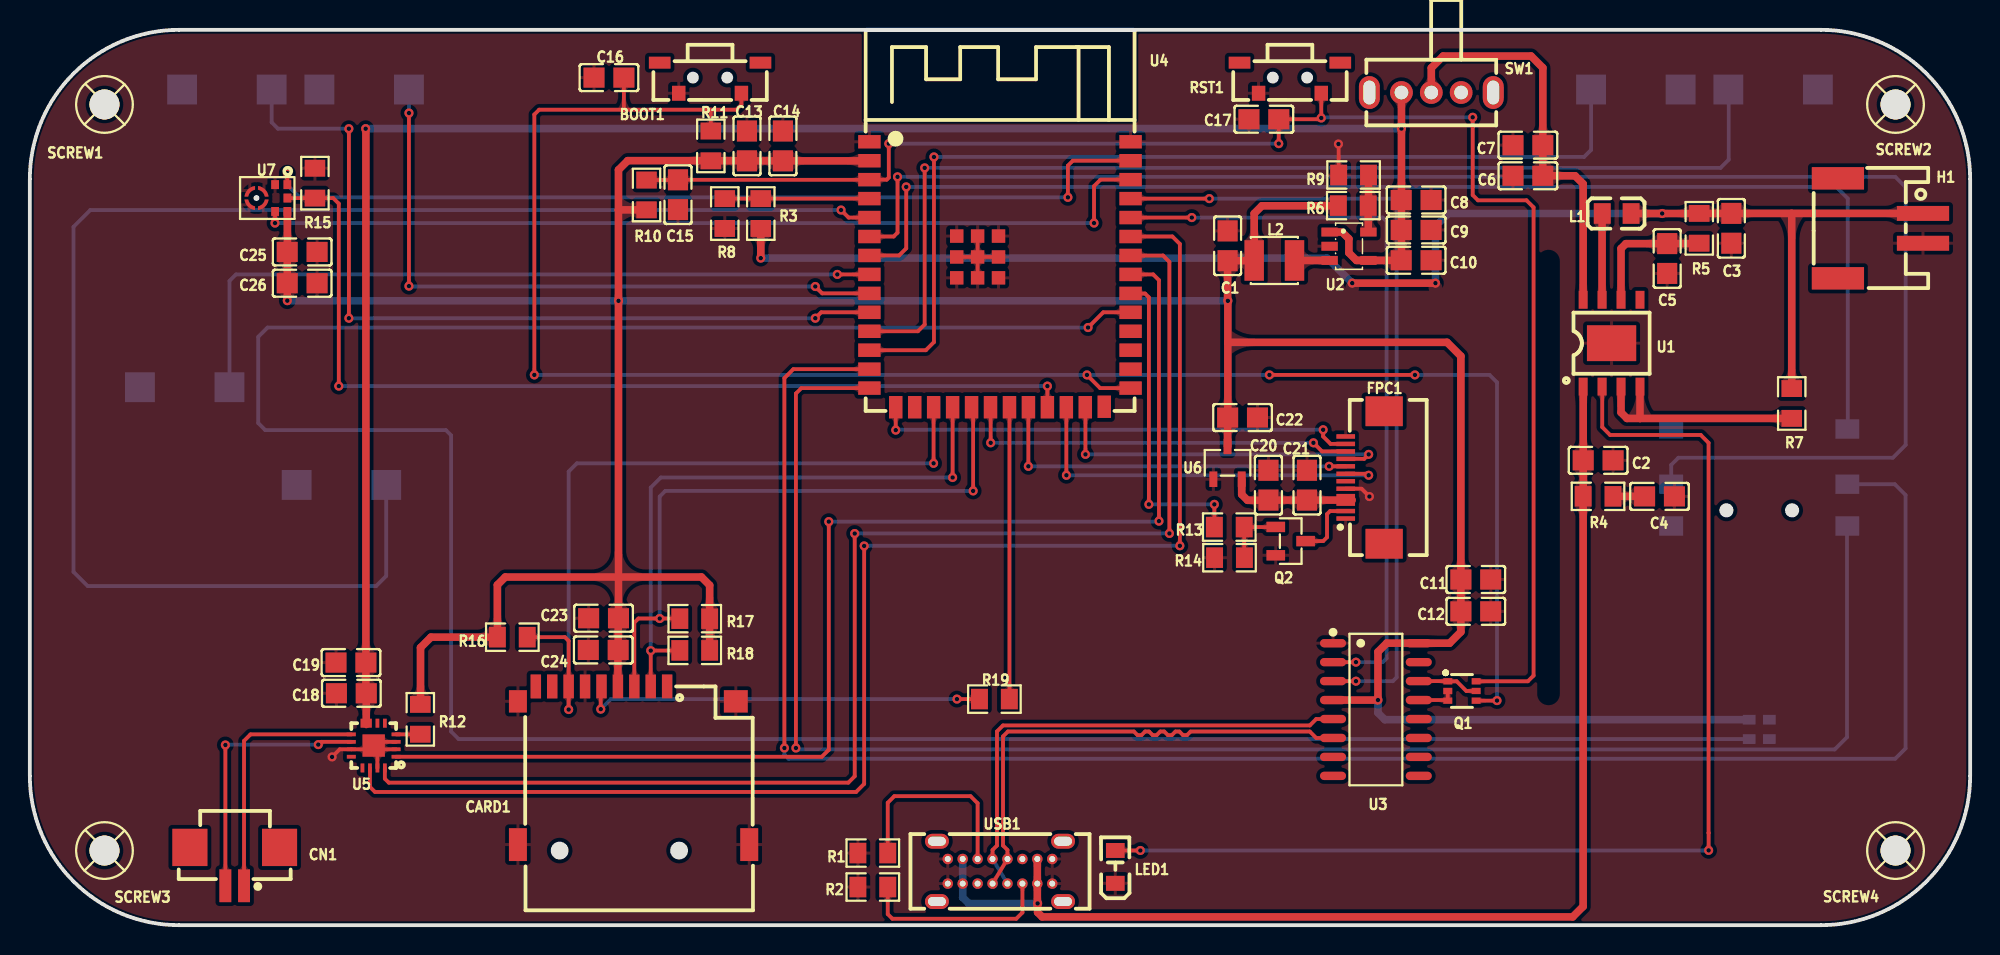
[diagram p1: board, top side]
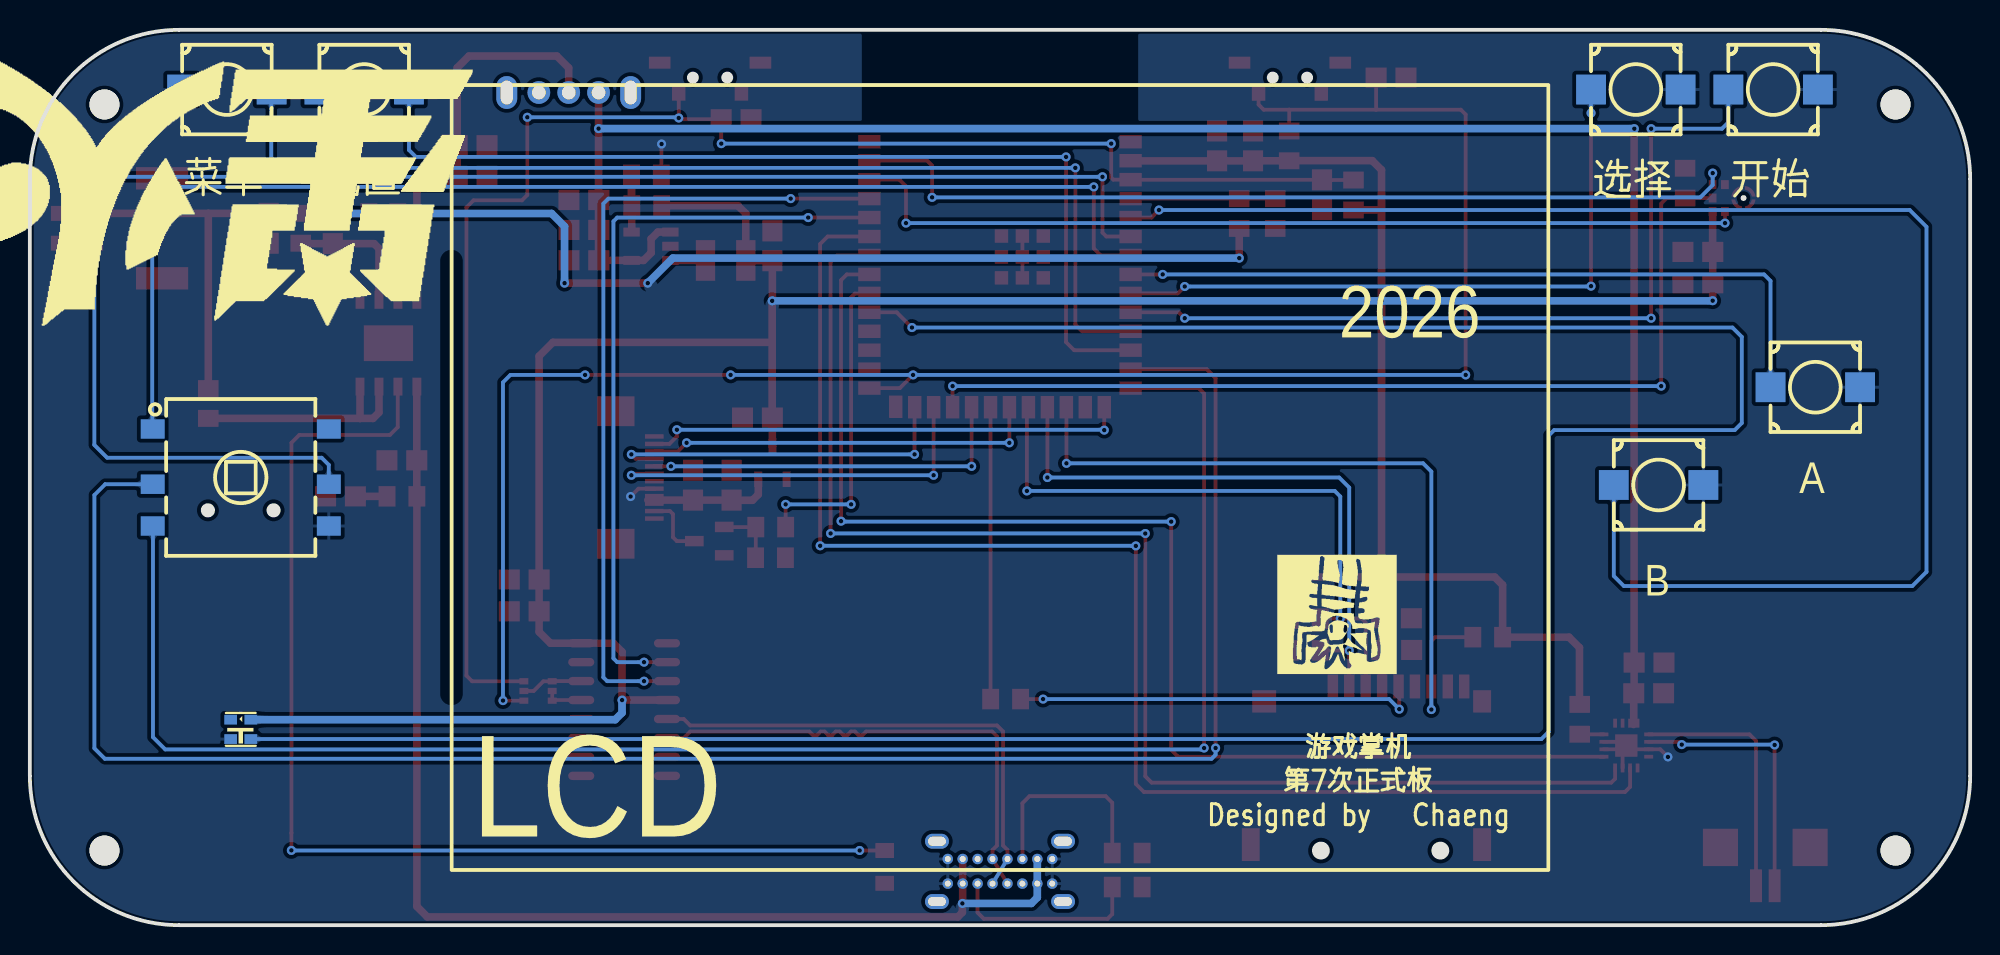
[diagram p2: board, bottom side, seen from below]

Outline 130 x 60 mm; copper layers: Top Layer, Bottom Layer. Coordinates in mm from the lower left corner of the outline.
Outline path: 0,50 0,10 arc(2.93,2.93) 10,0 120,0 arc(127.07,2.93) 130,10 130,50 arc(127.07,57.07) 120,60 10,60 arc(2.93,57.07) 0,50
Stack: Top Layer 0.035mm / Dielectric1 1.51mm FR4 er 4.5 / Bottom Layer 0.035mm

## Design rules (mm)
net D+: DP1
net D-: DP1
spacing copperThickness1oz (default): track to track 0.102, other pairs 0 to 0.3
spacing copperThickness2oz: track to track 0.203, other pairs 0.152 to 0.3
track width copperThickness1oz (default): min 0.127, default 0.254, max 2.54
track width copperThickness2oz: min 0.203, default 0.254, max 2.54
track width power: min 0.254, default 0.508, max 2.54
differential pair differentialPair (default): width min 0.127, default 0.254, max 2.54; gap min 0.152, default 0.152
net GND uses copperRegion

## Placement (name value [footprint] x y rotation side)
BOOT1  TS36CA-0.6  [SW-SMD_TS36CA]  45.58 56.77 180 top
C1  22uF  [C0805]  80.25 45.53 270 top
C2  10uF  [C0805]  105.07 31.15 180 top
C3  22uF  [C0805]  114 46.7 90 top
C4  10uF  [C0805]  109.19 28.73 180 top
C5  22uF  [C0805]  109.7 44.67 90 top
C6  22uF  [C0805]  100.37 50.22 0 top
C7  22uF  [C0805]  100.37 52.27 0 top
C8  22uF  [C0805]  92.88 48.6 180 top
C9  22uF  [C0805]  92.88 46.59 180 top
C10  100nF  [C0805]  92.88 44.56 180 top
C11  10uF  [C0805]  96.88 23.16 180 top
C12  100nF  [C0805]  96.88 21.03 180 top
C13  10uF  [C0805]  48.05 52.22 270 top
C14  100nF  [C0805]  50.46 52.22 270 top
C15  1uF  [C0805]  43.43 48.95 90 top
C16  100nF  [C0805]  38.8 56.8 180 top
C17  100nF  [C0805]  82.68 54.01 180 top
C18  10uF  [C0805]  21.54 15.54 180 top
C19  100nF  [C0805]  21.51 17.6 180 top
C20  10uF  [C0805]  82.98 29.49 270 top
C21  100nF  [C0805]  85.57 29.49 90 top
C22  10uF  [C0805]  81.25 34.02 0 top
C23  10uF  [C0805]  38.44 20.57 180 top
C24  100nF  [C0805]  38.42 18.44 180 top
C25  100nF  [C0805]  18.25 45.12 0 top
C26  10uF  [C0805]  18.25 43.02 180 top
CARD1  TF PUSH  [TF-SMD_TF-PUSH]  40.45 10.7 0 top
CN1  HC-1.25-2PWT  [CONN-SMD_2P-P1.25-HC-1.25-2PWT]  13.72 3.92 180 top
FPC1  FPC-05F-12PH20  [FPC-SMD_12P-P0.50_FPC-05F-12PH20]  89.45 30 90 top
H1  WAFER-PH2.0-2PWB  [CONN-SMD_2P-P2.00_XUNPU_WAFER-PH2.0-2PWB]  123.99 46.7 270 top
KEY1  HX TS665WS 200gf  [KEY-SMD_L6.0-W6.0-LS6.6]  116.8 56 0 bottom
KEY2  HX TS665WS 200gf  [KEY-SMD_L6.0-W6.0-LS6.6]  107.6 56 0 bottom
KEY3  HX TS665WS 200gf  [KEY-SMD_L6.0-W6.0-LS6.6]  22.4 56 180 bottom
KEY4  HX TS665WS 200gf  [KEY-SMD_L6.0-W6.0-LS6.6]  13.2 56 180 bottom
KEY5  HX TS665WS 200gf  [KEY-SMD_L6.0-W6.0-LS6.6]  10.38 36.05 180 bottom
KEY6  HX TS665WS 200gf  [KEY-SMD_L6.0-W6.0-LS6.6]  20.88 29.5 180 bottom
L1  1uH  [L0805]  106.32 47.69 0 top
L2  2.2uH  [IND-SMD_L3.0-W3.0_FNR30XXS]  83.38 44.55 0 top
LED1  XL-2012UOC  [LED0805-RD_ORANGE]  72.72 3.9 90 top
LED2  XL-2020RGBC-2812B  [LED-SMD_4P-L2.0-W2.0-BR-1]  115.87 13.12 0 bottom
Q1  UMH3N  [SC-70-6_L2.2-W1.3-P0.65-LS2.1-BR]  95.95 15.69 180 top
Q2  SS8050  [SOT-23-3_L2.9-W1.3-P1.90-LS2.4-BR]  84.48 25.74 180 top
R1  5.1kΩ  [R0805]  56.48 4.83 180 top
R2  5.1kΩ  [R0805]  56.48 2.55 0 top
R3  100kΩ  [R0805]  48.97 47.69 270 top
R4  2Ω  [R0805]  105.07 28.74 180 top
R5  500mΩ  [R0805]  111.85 46.7 90 top
R6  680kΩ  [R0805]  88.67 48.22 180 top
R7  1kΩ  [R0805]  118.05 34.96 90 top
R8  100kΩ  [R0805]  46.56 47.69 90 top
R9  150kΩ  [R0805]  88.69 50.27 0 top
R10  10kΩ  [R0805]  41.32 48.93 270 top
R11  10kΩ  [R0805]  45.62 52.22 90 top
R12  100kΩ  [R0805]  26.16 13.79 90 top
R13  2.2kΩ  [R0805]  80.36 26.68 0 top
R14  10kΩ  [R0805]  80.38 24.63 0 top
R15  100kΩ  [R0805]  19.1 49.72 90 top
R16  10kΩ  [R0805]  32.33 19.3 180 top
R17  10kΩ  [R0805]  44.55 20.54 0 top
R18  10kΩ  [R0805]  44.55 18.41 0 top
R19  22Ω  [R0805]  64.62 15.15 180 top
RST1  TS36CA-0.6  [SW-SMD_TS36CA]  84.43 56.78 180 top
SCREW1  -  [M2螺丝]  5 55 0 top
SCREW2  -  [M2螺丝]  125 55 0 top
SCREW3  -  [M2螺丝]  5 5 0 top
SCREW4  -  [M2螺丝]  125 5 0 top
SW1  SK12D07VG4-BF  [SW-TH_SK12D07VG4-BF]  93.9 55.8 180 top
SW2  10*10*9-6P WX  [SW-SMD-6P-L10.5-W10.0_C2858290]  115.87 30 180 bottom
U1  IP5306  [ESOP-8_L4.9-W3.9-P1.27-LS6.0-BL-EP]  105.97 39 0 top
U2  TLV62568DBVR  [SOT-23-5_L3.0-W1.7-P0.95-LS2.8-BR]  88.38 45.5 180 top
U3  CH340C  [SOP-16_L10.0-W3.9-P1.27-LS6.0-BL]  90.19 14.45 270 top
U4  ESP32-S3-WROOM-1-N16R8  [WIRELM-SMD_ESP32-S3-WROOM-1]  65 43.6 0 top
U5  MAX98357AETE+T  [TQFN-16_L3.0-W3.0-P0.50-BL-EP1.5]  23.04 12.03 90 top
U6  ME6210A33M3G  [SOT-23-3_L3.0-W1.7-P0.95-LS2.9-BR]  80.25 30.99 270 top
U7  ICS-43434  [MIC-SMD_6P-L3.5-W2.7-P0.90-BL]  15.97 48.73 180 top
USB1  HX-TYPE-C 16P 180 LC-B H15.0  [USB-C-TH_HX-TYPE-C-16P-180LC-BH15.0]  65 3.6 0 top

## Footprints (pads in the part's own frame, mm; a bottom-side part is the same pattern mirrored in y, then rotated)
C0805
  rect 1.41x1.35 smd: 1(-1,0) 2(1,0)
CONN-SMD_2P-P1.25-HC-1.25-2PWT
  rect 0.8x2.2 smd: 1(-0.625,1.285) 2(0.625,1.285)
  rect 2.35x2.5 smd: 3(-3.005,-1.285) 4(3.005,-1.285)
CONN-SMD_2P-P2.00_XUNPU_WAFER-PH2.0-2PWB
  rect 1x3.5 smd: 1(-1,2.85) 2(1,2.85)
  rect 1.5x3.5 smd: 4(3.35,-2.85) 5(-3.35,-2.85)
ESOP-8_L4.9-W3.9-P1.27-LS6.0-BL-EP
  rect 0.6x1.2 smd: 1(-1.905,-2.909) 2(-0.635,-2.909) 3(0.635,-2.909) 4(1.905,-2.909) 5(1.905,2.909) 6(0.635,2.909) 7(-0.635,2.909) 8(-1.905,2.909)
  rect 3.3x2.4 smd: 9(0,0)
FPC-SMD_12P-P0.50_FPC-05F-12PH20
  rect 0.3x1.25 smd: 1(-2.75,1.288) 2(-2.25,1.288) 3(-1.75,1.288) 4(-1.25,1.288) 5(-0.75,1.288) 6(-0.25,1.288) 7(0.25,1.288) 8(0.75,1.288) 9(1.25,1.288) 10(1.75,1.288) 11(2.25,1.288) 12(2.75,1.288)
  rect 2x2.5 smd: 13(4.44,-1.288) 14(-4.44,-1.288)
IND-SMD_L3.0-W3.0_FNR30XXS
  rect 1.3x2.72 smd: 1(1.35,0) 2(-1.35,0)
KEY-SMD_L6.0-W6.0-LS6.6
  rect 2x2 smd: 1(-3,0) 2(3,0)
L0805
  rect 1.133x1.377 smd: 1(-0.966,0) 2(0.966,0)
LED0805-RD_ORANGE
  rect 1x1.25 smd: 1(-1.1,0) 2(1.1,0)
LED-SMD_4P-L2.0-W2.0-BR-1
  rect 0.85x0.65 smd: 1(0.675,-0.65) 2(0.675,0.65) 3(-0.675,0.65) 4(-0.675,-0.65)
M2螺丝
  round 2 hole 2: 1(0,0)
MIC-SMD_6P-L3.5-W2.7-P0.90-BL
  rect 0.52x0.6 smd: 1(-1.286,-0.9) 2(-0.465,-0.9) 4(-0.465,0.9) 5(-1.286,0.9) 6(-1.286,0)
  custom 0.709x0.71 smd: 3(0.276,-0.452) 3(0.329,0.505) 3(1.234,-0.505) 3(1.286,0.452)
R0805
  rect 1.133x1.377 smd: 1(-1,0) 2(1,0)
SC-70-6_L2.2-W1.3-P0.65-LS2.1-BR
  rect 0.6x0.42 smd: 1(0.95,-0.65) 2(0.95,0) 3(0.95,0.65) 4(-0.95,0.65) 5(-0.95,0) 6(-0.95,-0.65)
SOP-16_L10.0-W3.9-P1.27-LS6.0-BL
  oval 0.56x1.745 smd: 1(-4.445,-2.873) 2(-3.175,-2.873) 3(-1.905,-2.873) 4(-0.635,-2.873) 5(0.635,-2.873) 6(1.905,-2.873) 7(3.175,-2.873) 8(4.445,-2.873) 9(4.445,2.873) 10(3.175,2.873) 11(1.905,2.873) 12(0.635,2.873) 13(-0.635,2.873) 14(-1.905,2.873) 15(-3.175,2.873) 16(-4.445,2.873)
SOT-23-3_L2.9-W1.3-P1.90-LS2.4-BR
  rect 1.25x0.7 smd: 1(1,-0.95) 2(1,0.95) 3(-1,0)
SOT-23-3_L3.0-W1.7-P0.95-LS2.9-BR
  rect 1.038x0.532 smd: 1(1.101,-0.95) 2(1.101,0.95) 3(-1.101,0)
SOT-23-5_L3.0-W1.7-P0.95-LS2.8-BR
  rect 1.1x0.6 smd: 1(1.3,-0.95) 2(1.3,0) 3(1.3,0.95) 4(-1.3,0.95) 5(-1.3,-0.95)
SW-SMD-6P-L10.5-W10.0_C2858290
  rect 1.6x1.3 smd: 1(-5.9,3.25) 2(-5.9,-0.45) 3(-5.9,-3.25) 4(5.9,-3.25) 5(5.9,-0.45) 6(5.9,3.25)
SW-SMD_TS36CA
  rect 1.45x0.8 smd: A(-3.375,-1.025) B(3.375,-1.025)
  rect 0.9x1 smd: C(-2.1,1.025) D(2.1,1.025)
SW-TH_SK12D07VG4-BF
  round 1.524 hole 0.914: 1(-2,0) 2(0,0) 3(2,0)
  oval 1.4x2.2 hole 0.8x1.6: 4(4.15,0) 5(-4.15,0)
TF-SMD_TF-PUSH
  rect 0.7x1.6 smd: 1(2.25,5.3) 2(1.15,5.3) 3(0.05,5.3) 4(-1.05,5.3) 5(-2.15,5.3) 6(-3.25,5.3) 7(-4.35,5.3) 8(-5.45,5.3) CD(-6.55,5.3)
  rect 1.2x1.5 smd: 10(-7.75,4.3)
  rect 1.2x2.2 smd: 11(-7.75,-5.3) 12(7.75,-5.3)
  rect 1.6x1.5 smd: 13(6.85,4.3)
TQFN-16_L3.0-W3.0-P0.50-BL-EP1.5
  rect 0.25x0.6 smd: 1(-0.749,-1.5) 2(-0.248,-1.5) 3(0.252,-1.5) 4(0.751,-1.5) 9(0.75,1.5) 10(0.25,1.5) 11(-0.25,1.5) 12(-0.749,1.5)
  rect 0.6x0.25 smd: 5(1.5,-0.748) 6(1.5,-0.248) 7(1.5,0.252) 8(1.5,0.752) 13(-1.5,0.752) 14(-1.5,0.252) 15(-1.5,-0.248) 16(-1.5,-0.748)
  rect 1.5x1.5 smd: 17(0,0)
USB-C-TH_HX-TYPE-C-16P-180LC-BH15.0
  oval 1.6x1 hole 1.2x0.6: 13(-4.225,2.02) 13(4.225,2.02) 14(-4.225,-2.02) 14(4.225,-2.02)
  round 0.7 hole 0.4: A1(-3.5,0.83) A4(-2.5,0.83) A5(-1.5,0.83) A6(-0.5,0.83) A7(0.5,0.83) A8(1.5,0.83) A9(2.5,0.83) A12(3.5,0.83) B1(3.5,-0.82) B4(2.5,-0.82) B5(1.5,-0.82) B6(0.5,-0.82) B7(-0.5,-0.82) B8(-1.5,-0.82) B9(-2.5,-0.82) B12(-3.5,-0.82)
WIRELM-SMD_ESP32-S3-WROOM-1
  rect 1.5x0.9 smd: 1(-8.75,8.895) 2(-8.75,7.625) 3(-8.75,6.355) 4(-8.75,5.085) 5(-8.75,3.815) 6(-8.75,2.545) 7(-8.75,1.275) 8(-8.75,0.005) 9(-8.75,-1.265) 10(-8.75,-2.535) 11(-8.75,-3.805) 12(-8.75,-5.075) 13(-8.75,-6.345) 14(-8.75,-7.615) 27(8.75,-7.615) 28(8.75,-6.345) 29(8.75,-5.075) 30(8.75,-3.805) 31(8.75,-2.535) 32(8.75,-1.265) 33(8.75,0.005) 34(8.75,1.275) 35(8.75,2.545) 36(8.75,3.815) 37(8.75,5.085) 38(8.75,6.355) 39(8.75,7.625) 40(8.75,8.895)
  rect 0.9x1.5 smd: 15(-6.985,-8.895) 16(-5.715,-8.895) 17(-4.445,-8.895) 18(-3.175,-8.895) 19(-1.905,-8.895) 20(-0.635,-8.895) 21(0.635,-8.895) 22(1.905,-8.895) 23(3.175,-8.895) 24(4.445,-8.895) 25(5.715,-8.895) 26(6.985,-8.865)
  rect 0.9x0.9 smd: 41(-2.9,2.575) 41(-2.9,1.175) 41(-2.9,-0.225) 41(-1.5,2.575) 41(-1.5,1.175) 41(-1.5,-0.225) 41(-0.1,2.575) 41(-0.1,1.175) 41(-0.1,-0.225)

## Nets
As in the schematic.

Pads without a net: BOOT1 A B; CARD1 1 8 CD; CN1 3 4; FPC1 6 13 14; H1 4 5; LED2 1; RST1 A B; SCREW1 1; SCREW2 1; SCREW3 1; SCREW4 1; SW1 1 4 5; SW2 6; U1 5; U3 7 8 9 10 11 12 15; U4 16 26 28 29 30; U5 5 6 12 13; USB1 13 14 A8 B8

## Via types
v1: diameter 0.61, hole 0.305, Top Layer to Bottom Layer, 78 vias

## Routing (per net, layer and track width the routed paths; a pad name or vN(x,y) marks a point on that pad's centre or on a via; arc(x,y) is an arc through that point)
3V3LCD: length 8.6
  Top Layer w0.508: 81.2,29.88 81.2,28.86 81.59,28.47 82.97,28.47 C20.2 C21.1 88.59,28.49
3V3M: length 250.4
  Top Layer w0.508: v1(17.25,41.85) 17.25,43.01 C26.2 C25.1 17.25,45.13 U7.5 ; 39.44,23.33 C23.1 39.42,20.55 C24.1 39.4,18.42 CARD1.4 ; 39.44,23.33 39.44,47.94 ; 39.44,23.33 31.86,23.33 31.33,22.8 R16.2 26.88,19.3 26.17,18.6 26.17,14.81 R12.2 ; 39.44,23.33 45,23.33 45.55,22.78 R17.2 R18.2 ; U4.2 56.24,51.22 C14.2 C13.2 48.04,51.22 R11.1 45.61,51.23 40.06,51.23 39.44,50.61 39.44,47.94 ; 39.44,47.93 R10.2 ; U3.4 v1(90.32,15.08) 90.32,18.31 90.91,18.9 93.05,18.9 U3.16 95.12,18.89 95.88,19.65 C12.2 C11.2 95.88,38.13 94.95,39.06 80.26,39.06 ; 80.26,39.06 80.26,34.03 C22.1 80.25,32.09 U6.3 ; 80.26,39.06 v1(80.26,41.84) 80.25,41.85 C1.2 82.01,44.53 L2.2 82.03,47.69 82.55,48.21 87.66,48.21 R6.2
  Bottom Layer w0.508: v1(17.25,41.85) 17.26,41.84 v1(39.44,41.84) v1(80.26,41.84) ; LED2.4 90.78,13.77 90.32,14.23 v1(90.32,15.08)
+5V: length 126.7
  Top Layer w0.508: 22.54,13.45 C18.1 22.51,15.56 C19.1 22.51,53.36 v1(22.5,53.38) ; U2.1 87.92,46.45 88.38,45.99 88.38,45.06 88.88,44.55 U2.4 91.87,44.55 C10.2 91.9,44.57 v1(91.9,53.38) SW1.3
  Bottom Layer w0.508: v1(91.9,53.38) 22.51,53.38 v1(22.5,53.38)
GND: length 17
  Top Layer w0.254: 63.5,44.78 64.9,44.78 ; 63.5,44.78 U4.41 ; 63.5,44.78 62.1,44.78 ; 63.5,44.78 U4.41 ; 23.29,11.79 U5.17 ; 23.29,11.79 U5.2 ; 23.29,11.79 U5.15 ; U5.17 22.79,11.78 U5.11 20.76,11.78 v1(20.25,11.28) ; U5.17 23.29,12.29 U5.3 ; FPC1.5 89.22,29.25 v1(89.75,28.72) ; R9.1 87.69,52.34 v1(87.68,52.35)
VBUS: length 83.1
  Top Layer w0.508: v1(67.52,1.46) 67.52,0.86 67.82,0.55 103.37,0.55 104.07,1.25 R4.2 104.07,28.74 C2.2 104.07,36.09 U1.1 ; USB1.A9 USB1.B4 67.5,1.46
  Bottom Layer w0.508: USB1.A4 USB1.B9 62.5,1.85 62.9,1.46 v1(67.52,1.46)
BAT+: length 98.5
  Top Layer w0.508: H1.1 114,47.7 ; R3.2 48.97,44.71 v1(48.97,44.7) ; R5.2 111.84,47.69 v1(109.37,47.69) L1.2 ; v1(88.6,43.02) v1(94.18,43.02) ; R7.2 118.05,47.7 ; C3.2 111.85,47.7
  Bottom Layer w0.508: v1(94.18,43.02) 94.18,46.82 95.04,47.69 v1(109.37,47.69) ; v1(88.6,43.02) 86.92,44.7 v1(48.97,44.7)
CHIP_PU: length 106.1
  Top Layer w0.254: v1(96.67,54.14) 96.67,48.93 97.03,48.57 100.28,48.57 100.75,48.1 100.75,16.72 100.37,16.34 Q1.6 ; v1(57.55,52.38) 57.55,50.1 57.41,49.96 U4.3 56.24,49.95 C15.2 43.41,49.93 R10.1 ; RST1.C v1(86.53,54.09) 86.44,54.01 C17.1 83.68,54 v1(83.68,52.38)
  Bottom Layer w0.254: v1(96.67,54.14) 86.57,54.14 v1(86.53,54.09) ; v1(57.55,52.38) v1(83.68,52.38)
D+: length 33.5
  Top Layer w0.254: U3.5 86.19,13.81 85.75,13.38 65.2,13.38 64.8,12.98 64.8,5.33 64.5,5.04 USB1.A6
  Bottom Layer w0.254: USB1.B6 USB1.A6
D-: length 33.5
  Top Layer w0.254: U3.6 86.19,12.54 85.75,12.98 77.77,12.98 77.53,12.73 77.26,12.73 77.02,12.98 76.75,12.98 76.51,12.73 76.25,12.73 76,12.98 75.74,12.98 75.5,12.73 75.23,12.73 74.99,12.98 74.72,12.98 74.48,12.73 74.21,12.73 73.97,12.98 65.53,12.98 65.2,12.65 65.2,5.33 65.5,5.04 USB1.A7 USB1.B7
DTR: length 2.6
  Top Layer w0.254: U3.13 94.96,15.08 95,15.04 Q1.2
GPIO0: length 126.7
  Top Layer w0.254: R11.2 45.62,54.65 ; BOOT1.C 47.68,54.99 47.34,54.65 34.12,54.65 33.8,54.32 v1(33.8,36.88) ; v1(98.3,15.05) 98.29,15.04 96.9,15.04 ; v1(92.8,36.88) v1(83.05,36.88) ; C16.1 39.8,54.65 ; v1(70.82,36.88) 71.71,35.99 U4.27
  Bottom Layer w0.254: v1(98.3,15.05) 98.3,36.38 97.8,36.88 v1(92.8,36.88) ; v1(83.05,36.88) v1(70.82,36.88) v1(33.8,36.88)
GPIO1: length 60.7
  Top Layer w0.254: v1(17.25,50.4) 17.25,49.63 U7.1 ; v1(69.55,48.77) 69.55,50.9 69.88,51.23 U4.39
  Bottom Layer w0.254: v1(17.25,50.4) 17.25,49.6 18.08,48.77 v1(69.55,48.77)
GPIO2: length 60.8
  Top Layer w0.254: U4.38 71.74,49.96 71.3,49.52 v1(71.3,47.05) ; v1(16.42,47.05) 16.42,47.82 U7.4
  Bottom Layer w0.254: v1(71.3,47.05) v1(16.42,47.05)
GPIO3: length 32.3
  Top Layer w0.254: v1(86.65,33.2) 86.65,32.75 87.15,32.25 FPC1.11 ; U4.15 v1(58.01,33.17)
  Bottom Layer w0.254: v1(58.01,33.17) 58.04,33.2 v1(86.65,33.2)
GPIO4: length 9.7
  Top Layer w0.254: 56.25,48.69 R3.1 R8.2
GPIO5: length 104.8
  Top Layer w0.254: U4.5 54.85,47.42 v1(54.35,47.92)
  Bottom Layer w0.254: KEY6.1 23.88,23.4 23.2,22.72 3.88,22.72 2.92,23.67 2.92,46.8 4.05,47.92 v1(54.35,47.92)
GPIO6: length 108.4
  Top Layer w0.254: U4.6 57.88,46.15 58.13,46.41 v1(58.13,50.15)
  Bottom Layer w0.254: 110,29.57 SW2.5 109.97,30.84 110.45,31.32 124.82,31.32 125.68,32.18 125.68,49.45 124.98,50.15 v1(58.13,50.15)
GPIO7: length 85.6
  Top Layer w0.254: U4.7 58.24,44.88 58.72,45.36 v1(58.72,49.47)
  Bottom Layer w0.254: v1(58.72,49.47) 121.02,49.47 121.8,48.7 121.8,33.28 SW2.1
GPIO8: length 65.2
  Top Layer w0.254: v1(60.57,51.48) 60.57,39.07 60.03,38.53 U4.12
  Bottom Layer w0.254: KEY2.1 104.6,51.95 104.13,51.48 v1(60.57,51.48)
GPIO9: length 51.9
  Top Layer w0.254: v1(60.55,30.95) 60.55,34.7 U4.17 ; CARD1.7 v1(36.1,14.45) ; R16.1 35.85,19.3 36.1,19.05 36.1,16
  Bottom Layer w0.254: v1(60.55,30.95) 36.65,30.95 36.1,30.4 v1(36.1,14.45)
GPIO10: length 40.5
  Top Layer w0.254: 41.6,16 v1(41.6,18.4) 43.53,18.4 R18.1 ; U4.18 v1(61.82,30)
  Bottom Layer w0.254: v1(61.82,30) 42.28,30 41.6,29.32 v1(41.6,18.4)
GPIO11: length 42.4
  Top Layer w0.254: U4.19 63.2,34.6 v1(63.2,29.1) ; CARD1.3 40.5,20.27 40.78,20.55 v1(42.2,20.55) 43.54,20.55 R17.1
  Bottom Layer w0.254: v1(63.2,29.1) 42.57,29.1 42.2,28.72 v1(42.2,20.55)
GPIO12: length 26.4
  Top Layer w0.254: U4.20 64.38,34.7 v1(64.38,32.32) ; FPC1.10 86.57,31.75 v1(86,32.32)
  Bottom Layer w0.254: v1(86,32.32) v1(64.38,32.32)
GPIO13: length 19.6
  Top Layer w0.254: U4.21 65.63,15.16 R19.1
GPIO14: length 25.2
  Top Layer w0.254: FPC1.8 v1(87.05,30.75) ; U4.22 66.9,34.7 v1(66.9,30.75)
  Bottom Layer w0.254: v1(87.05,30.75) v1(66.9,30.75)
GPIO15: length 50.2
  Top Layer w0.254: U4.8 v1(54.1,43.61)
  Bottom Layer w0.254: KEY5.1 13.38,43.17 13.81,43.61 v1(54.1,43.61)
GPIO16: length 44.2
  Top Layer w0.254: v1(52.62,42.8) 53.09,42.34 U4.9 ; v1(25.4,42.82) v1(25.4,54.42)
  Bottom Layer w0.254: v1(25.4,54.42) KEY3.1 ; v1(25.4,42.82) 25.42,42.8 v1(52.62,42.8)
GPIO17: length 55.3
  Top Layer w0.254: v1(21.38,40.67) v1(21.38,53.38) ; v1(52.62,40.67) 53.02,41.07 U4.10
  Bottom Layer w0.254: KEY4.1 16.2,53.8 16.62,53.38 v1(21.38,53.38) ; v1(52.62,40.67) v1(21.38,40.67)
GPIO18: length 73.2
  Top Layer w0.254: v1(59.95,50.75) 59.95,40.25 59.5,39.8 56.25,39.8
  Bottom Layer w0.254: v1(59.95,50.75) 113.28,50.75 113.82,51.3 113.82,55.97 KEY1.1
GPIO19: length 127.9
  Top Layer w0.254: v1(50.55,11.87) 50.55,36.66 51.15,37.26 U4.13
  Bottom Layer w0.254: SW2.2 124.95,29.55 125.68,28.82 125.68,11.85 124.97,11.15 50.83,11.15 50.55,11.42 v1(50.55,11.87)
GPIO20: length 113.8
  Top Layer w0.254: U4.14 51.69,35.99 51.32,35.62 v1(51.32,11.87)
  Bottom Layer w0.254: SW2.3 121.75,26.73 121.75,12.6 120.93,11.77 51.53,11.77 51.43,11.87 v1(51.32,11.87)
GPIO21: length 64.7
  Top Layer w0.254: U4.23 v1(68.18,36.12) ; v1(20.7,36.12) 20.7,48.35 20.33,48.72 R15.1 17.26,48.72 U7.6
  Bottom Layer w0.254: v1(68.18,36.12) v1(20.7,36.12)
GPIO38: length 185.2
  Top Layer w0.254: U4.31 71.92,41.07 v1(70.9,40.05)
  Bottom Layer w0.254: LED2.3 115.19,12.47 28.72,12.47 28.22,12.97 28.22,32.82 27.88,33.17 15.78,33.17 15.3,33.65 15.3,39.42 15.92,40.05 v1(70.9,40.05)
GPIO39: length 21.1
  Top Layer w0.254: U4.32 73.76,42.32 74.72,42.32 74.97,42.07 v1(74.97,28.2) ; R13.1 v1(79.36,28.2)
  Bottom Layer w0.254: v1(79.36,28.2) v1(74.97,28.2)
GPIO40: length 84.8
  Top Layer w0.254: v1(53.53,27.04) 53.53,11.75 53.06,11.29 U5.1 ; U4.33 75.26,43.61 75.65,43.22 v1(75.65,27.07)
  Bottom Layer w0.254: v1(75.65,27.07) 75.62,27.04 v1(53.53,27.04)
GPIO41: length 90.8
  Top Layer w0.254: 23.79,10.53 23.79,9.81 24.05,9.55 54.84,9.55 55.27,9.98 v1(55.27,26.25) ; U4.34 73.75,44.88 75.93,44.88 76.35,44.45 v1(76.35,26.25)
  Bottom Layer w0.254: v1(76.35,26.25) 55.51,26.25 55.51,26.25 v1(55.27,26.25)
GPIO42: length 95.6
  Top Layer w0.254: U4.35 76.55,46.15 77.05,45.65 v1(77.05,25.42) ; 22.79,10.53 22.79,9.26 23.12,8.92 55.36,8.92 55.9,9.47 v1(55.9,25.42)
  Bottom Layer w0.254: v1(55.9,25.42) 56.18,25.42 56.18,25.42 v1(77.05,25.42)
GPIO47: length 26.4
  Top Layer w0.254: v1(89.7,30.15) 89.6,30.25 FPC1.7 ; v1(69.45,30.15) 69.44,30.16 U4.24
  Bottom Layer w0.254: v1(89.7,30.15) v1(69.45,30.15)
GPIO48: length 23.8
  Top Layer w0.254: U4.25 70.72,34.7 v1(70.72,31.55) ; v1(89.7,31.55) 89.4,31.25 FPC1.9
  Bottom Layer w0.254: v1(89.7,31.55) v1(70.72,31.55)
RTS: length 4.1
  Top Layer w0.254: U3.14 94.99,16.35 Q1.1 95.59,16.34 96.24,15.69 Q1.5
U0RXD: length 50.2
  Top Layer w0.254: U4.36 v1(77.85,47.42) ; v1(88.85,17.62) U3.2
  Bottom Layer w0.254: v1(88.85,17.62) 90.65,17.62 90.9,17.88 90.9,47.17 90.65,47.42 v1(77.85,47.42)
U0TXD: length 54.1
  Top Layer w0.254: U4.37 v1(79.03,48.69) ; v1(88.85,16.35) 87.32,16.35 U3.3
  Bottom Layer w0.254: v1(88.85,16.35) 91.32,16.35 91.57,16.6 91.57,48.35 91.24,48.69 v1(79.03,48.69)
VOUT: length 27.7
  Top Layer w0.508: SW1.2 93.9,57.45 94.69,58.24 100.58,58.24 101.37,57.46 C7.2 C6.2 103.53,50.22 104.07,49.68 U1.8
$1N34531: length 4.2
  Top Layer w0.254: R14.2 81.36,24.64 R13.2 83.47,26.68 Q2.1
$1N34538: length 4.4
  Top Layer w0.254: Q2.3 86.65,25.74 86.91,26 86.91,27.55 87.11,27.75 FPC1.2
$1N34554: length 13.5
  Top Layer w0.254: USB1.A5 63.5,8.17 63.02,8.64 57.92,8.64 57.48,8.2 R1.1
$1N34556: length 13.1
  Top Layer w0.254: R2.2 57.48,0.74 57.79,0.43 66.08,0.43 66.5,0.85 66.5,2.78 USB1.B5
$1N34586: length 8.8
  Top Layer w0.508: 106.61,41.91 106.61,45.34 106.93,45.67 109.69,45.67 C5.2 111.82,45.67 R5.1
$1N34588: length 5.8
  Top Layer w0.508: U1.7 105.34,47.68 L1.1
$1N34595: length 77.4
  Top Layer w0.254: LED1.2 v1(74.4,5) ; U1.2 105.35,36.08 105.35,33.38 105.88,32.85 111.95,32.85 112.47,32.33 112.47,6.18 112.48,6.18 v1(112.48,5.01)
  Bottom Layer w0.254: v1(74.4,5) 112.47,5 v1(112.48,5.01)
$1N34601: length 15.5
  Top Layer w0.508: U1.4 107.88,33.96 ; 107.88,33.96 107.01,33.96 106.61,34.36 106.61,36.09 ; 107.88,33.96 118.04,33.96
$1N34619: length 2.1
  Top Layer w0.508: R4.1 108.18,28.74 C4.2
$1N34652: length 2.4
  Top Layer w0.508: L2.1 87.08,44.55 U2.3
$1N34657: length 3.8
  Top Layer w0.508: R9.2 89.69,48.24 R6.1 89.67,46.46 U2.5
$1N34720: length 17.1
  Top Layer w0.254: U5.9 14.78,12.78 14.35,12.35 CN1.1
$1N34722: length 18
  Top Layer w0.254: v1(19.33,12.1) 19.51,12.29 U5.10 ; CN1.2 v1(13.1,12.07)
  Bottom Layer w0.254: v1(19.33,12.1) 13.12,12.1 v1(13.1,12.07)
$1N34731: length 1.6
  Top Layer w0.254: U5.4 26.15,12.79 R12.1
$1N34770: length 27.2
  Top Layer w0.254: v1(38.25,14.47) 38.25,15.95 CARD1.5 ; R19.2 v1(62.11,15.15)
  Bottom Layer w0.254: v1(38.25,14.47) 38.92,15.15 v1(62.11,15.15)

## Copper pours and planes (outline as drawn; the poured copper is in the pictures)
GND on Top Layer: -1.5,60.82 130.97,60.82 130.97,-0.58 -1.5,-0.58
GND on Bottom Layer: -0.6,60.6 130.75,60.6 130.75,-0.8 -0.6,-0.8

Small or netless copper shapes (teardrops, artwork), in the pictures only: 304 on Top Layer, 93 on Bottom Layer

## Text on the board
Bottom Silkscreen Layer: 游戏掌机 / 第7次正式板 / Designed by   Chaeng | A | 开始 | B | 选择 | 配置 | 菜单 | 2026 | LCD
